# EAGLE design cable 3 (EAGLE 7.6.0)
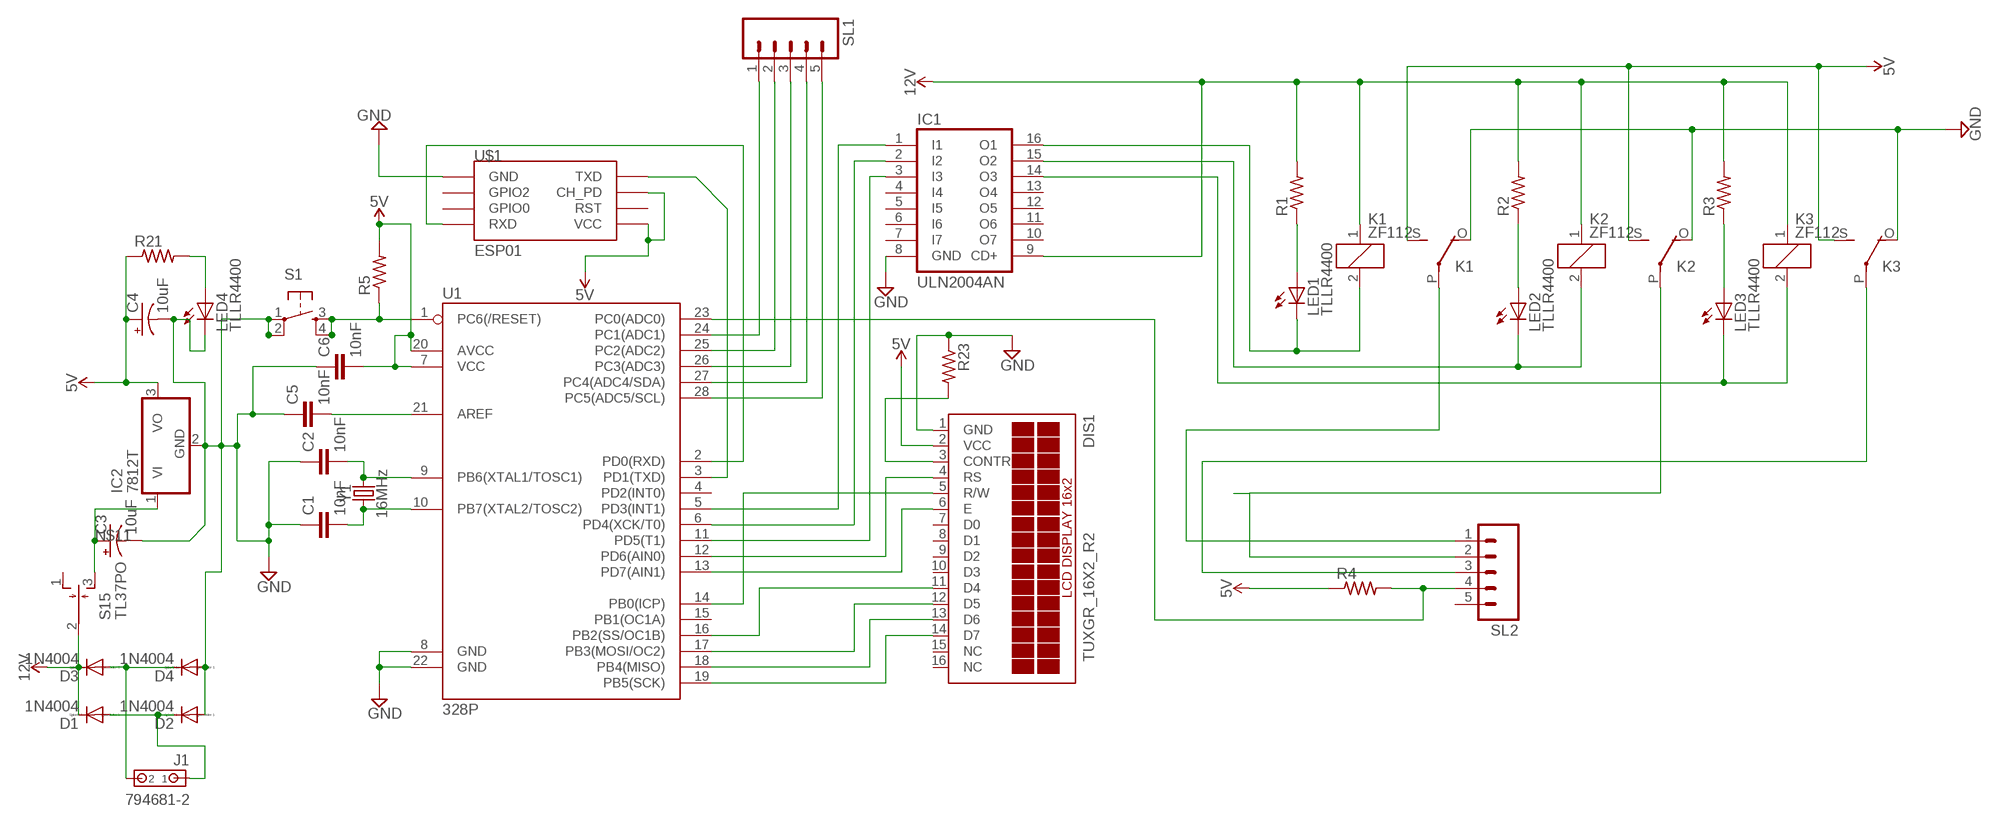
[diagram p0: schematic, sheet 1]

## Parts
C1  10nF  10NF-PTH-10MM-10000V-1-%  [CAP-PTH-10MM]
C2  10nF  10NF-PTH-10MM-10000V-1-%  [CAP-PTH-10MM]
C3  10uF  10UF-POLAR-RADIAL-2.5MM-KIT-25V-20%  [CPOL-RADIAL-2.5MM-5MM-KIT]
C4  10uF  10UF-POLAR-RADIAL-2.5MM-KIT-25V-20%  [CPOL-RADIAL-2.5MM-5MM-KIT]
C5  10nF  10NF-PTH-10MM-10000V-1-%  [CAP-PTH-10MM]
C6  10nF  10NF-PTH-10MM-10000V-1-%  [CAP-PTH-10MM]
D1  1N4004  [DO41-10]
D2  1N4004  [DO41-10]
D3  1N4004  [DO41-10]
D4  1N4004  [DO41-10]
DIS1  TUXGR_16X2_R2  [TUXGR_16X2_R2]
IC1  ULN2004AN  [DIL16]
IC2  7812T  [TO220H]
J1  794681-2  [794681-2]
K1  ZF112  [ZF112]
K2  ZF112  [ZF112]
K3  ZF112  [ZF112]
LED1  TLLR4400  [LED3MM]
LED2  TLLR4400  [LED3MM]
LED3  TLLR4400  [LED3MM]
LED4  TLLR4400  [LED3MM]
R1  R-US_0207/12  [0207/12]
R2  R-US_0207/12  [0207/12]
R3  R-US_0207/12  [0207/12]
R4  R-US_0207/12  [0207/12]
R5  R-US_0207/12  [0207/12]
R21  R-US_0207/12  [0207/12]
R23  R-US_0207/12  [0207/12]
S1  TAC_SWITCHPTH  [TACTILE-PTH]
S15  TL37PO  [TL3XPO]
SL1  MA05  [05PA]
SL2  MA05  [05PA]
U1  328P  ATMEGA328P_PDIP  [DIP28]
U$1  ESP01  [ESP01]
Y1  16MHz  CRYSTAL-16MHZPTH-HC49US  [HC49US]

## Nets
5V: C4.1(+) C6.2 DIS1.2(VCC) IC2.3(VO) K1.S(2:S) K2.S(2:S) K3.S(2:S) R4.1 R5.2 R21.1 U1.7(VCC) U1.20(AVCC) U$1.CH_PD U$1.VCC
12V: D1.C D3.C IC1.9(CD+) K1.1 K2.1 K3.1 R1.2 R2.2 R3.2 S15.2(P)
GND: C1.1 C2.1 C3.2(-) C4.2(-) C5.1 C6.1 D2.A D4.A DIS1.1(GND) IC1.8(GND) IC2.2(GND) K1.O(2:O) K2.O(2:O) K3.O(2:O) LED4.K(C) R23.1 S1.1 S1.2 U1.8(GND) U1.22(GND) U$1.GND
N$1: DIS1.3(CONTR) R23.2
N$2: U1.2(PD0(RXD)) U$1.RX(RXD)
N$3: C2.2 U1.9(PB6(XTAL1/TOSC1)) Y1.2
N$4: C1.2 U1.10(PB7(XTAL2/TOSC2)) Y1.1
N$5: LED4.A R21.2
N$6: C5.2 U1.21(AREF)
N$7: SL1.4 U1.27(PC4(ADC4/SDA))
N$9: R5.1 S1.3 S1.4 U1.1(PC6(/RESET))
N$10: D3.A D4.C J1.2
N$11: C3.1(+) IC2.1(VI) S15.3(S)
N$12: U1.3(PD1(TXD)) U$1.TX(TXD)
N$13: DIS1.11(D4) U1.16(PB2(SS/OC1B))
N$14: DIS1.12(D5) U1.17(PB3(MOSI/OC2))
N$15: DIS1.13(D6) U1.18(PB4(MISO))
N$16: SL1.5 U1.28(PC5(ADC5/SCL))
N$17: DIS1.14(D7) U1.19(PB5(SCK))
N$18: DIS1.6(E)
N$19: DIS1.4(RS) U1.12(PD6(AIN0))
N$20: LED1.A R1.1
N$21: IC1.16(O1) K1.2 LED1.K(C)
N$22: IC1.15(O2) K2.2 LED2.K(C)
N$23: LED2.A R2.1
N$24: IC1.14(O3) K3.2 LED3.K(C)
N$25: LED3.A R3.1
N$26: IC1.1(I1) U1.5(PD3(INT1))
N$27: IC1.2(I2) U1.6(PD4(XCK/T0))
N$28: K1.P(2:P) SL2.1
N$29: R4.2 SL2.4 U1.23(PC0(ADC0))
N$30: DIS1.5(R/W) U1.14(PB0(ICP))
N$31: SL1.3 U1.26(PC3(ADC3))
N$32: K2.P(2:P) SL2.2
N$33: K3.P(2:P) SL2.3
N$34: SL1.2 U1.25(PC2(ADC2))
N$35: SL1.1 U1.24(PC1(ADC1))
N$48: IC1.3(I3) U1.11(PD5(T1))
N$50: D1.A D2.C J1.1
Unconnected: DIS1.7(D0) DIS1.8(D1) DIS1.9(D2) DIS1.10(D3) DIS1.15(NC) DIS1.16(NC) IC1.4(I4) IC1.5(I5) IC1.6(I6) IC1.7(I7) IC1.10(O7) IC1.11(O6) IC1.12(O5) IC1.13(O4) S15.1(O) SL2.5 U1.4(PD2(INT0)) U1.13(PD7(AIN1)) U1.15(PB1(OC1A)) U$1.GPIO0 U$1.GPIO2 U$1.RST

## Library data of the parts
C1 C2 C5 C6 = SparkFun-Capacitors:10NF: 0.01uF/10nF/10,000pF ceramic capacitors A capacitor is a passive two-terminal electrical component used to store electrical energy temporarily in an electric field. CAP-09321; PROD_ID: CAP-09321
C3 C4 = SparkFun-Capacitors:10UF-POLAR: 10.0µF polarized capacitors A capacitor is a passive two-terminal electrical component used to store electrical energy temporarily in an electric field.; PROD_ID: CAP-08440
D1-D4 = diode:1N4004: DIODE general purpose rectifier, 1 A
DIS1 = display-lcd:TUXGR_16X2_R2: Tuxgraphics LCD display 16x2 characters reflective, without background light Source: tuxgr_12x2_r2.pdf; OC_FARNELL: unknown; OC_NEWARK: unknown
IC1 = uln-udn:ULN2004A: DRIVER ARRAY
IC2 = linear:78*: Positive VOLTAGE REGULATOR Source: http://cache.national.com/ds/LM/LM78L05.pdf http://www.fairchildsemi.com/ds/LM/LM7805.pdf
J1 = con-amp:794681-2: Micro MATE-N-LOK Connectors grid 1.5mm Dual Row Through Hole Vertical Metal Through Hole Holddowns Source: ENG_CD_794681_E.pdf
K1-K3 = relay:ZF112: RELAY 1 x switch; OC_FARNELL: unknown; OC_NEWARK: unknown
LED1-LED4 = led:TLLR4400: Low Current (2mA) LED 3 mm Tinted Diffused Package color RED Source: Data sheet <http://www.farnell.com/datasheets/391100.pdf>; MF: VISHAY SEMICONDUCTOR; OC_FARNELL: 1612437
R1-R5 R21 R23 = rcl:R-US_: RESISTOR, American symbol
S1 = SparkFun-Retired:TAC_SWITCH: Momentary Switch Button commonly used for reset or general input. Spark Fun Electronics SKU : COM-00097 SMT- SWCH-08247
S15 = switch:TL37PO: TINY SWITCH MOM OFF MOM Source: http://www2.produktinfo.conrad.com/datenblaetter/700000-724999/705152-da-01-de-Subminiaturschalter_TL_36YO.pdf
SL1 SL2 = con-amp-quick:MA05: AMP QUICK CONNECTOR; OC_FARNELL: unknown; OC_NEWARK: unknown
U1 = SparkFun-IC-Microcontroller:ATMEGA328P_PDIP: Atmel 328P Through hole ATMEGA328P uC used in the Arduino 32kb flash, 1k EEPROM, 2k SRAM Datasheet <http://www.sparkfun.com/datasheets/Components/SMD/ATMega328.pdf> SparkFun Products Storefront component: AVR 28 Pin 20MHz 32K 6A/D - ATMega328P <https://www.sparkfun.com/products/9061> (COM-09061) SparkFun Simon Says - Through-Hole Soldering Kit <https://www.sparkfun.com/products/10547> (KIT-10547) SparkFun Learn to Solder - Simon Says <https://www.sparkfun.com/products/13708> (KIT-13708) SparkFun BigTime Watch Kit <https://www.sparkfun.com/products/11734> (KIT-11734) SparkFun ClockIt <https://www.sparkfun.com/products/10930> (KIT-10930) SparkFun Serial Enabled LCD Kit <https://www.sparkfun.com/products/10097> (LCD-10097) SparkFun Simon Tilts - Through Hole Soldering Kit <https://www.sparkfun.com/products/12634> (KIT-12634) SparkFun Frequency Counter Kit <https://www.sparkfun.com/products/10140> (KIT-10140) FabFM Radio Kit <https://www.sparkfun.com/products/11043> (KIT-11043) SparkFun Binary Blaster Kit <https://www.sparkfun.com/products/12037> (KIT-12037) SparkFun Metro-Gnome <https://www.sparkfun.com/products/9236> (KIT-09236) ATmega328 with Arduino Optiboot (Uno) <https://www.sparkfun.com/products/10524> (DEV-10524); PROD_ID: IC-09136
U$1 = esp8266modules:ESP01: ESP8266 Wifi module 01
Y1 = SparkFun-Clocks:CRYSTAL-16MHZ: 16MHz Crystal Digikey Example <http://www.digikey.com/product-search/en?keywords=535-9122-1-ND> Frequency: 16MHz Frequency Stability: ±50ppm Frequency Tolerance: ±20ppm Load Capacitance: 18pF SparkFun Products: Pro Micro -5V/16MHz <https://www.sparkfun.com/products/12640> SparkFun Serial Enabled LCD Kit <https://www.sparkfun.com/products/10097>; PROD_ID: XTAL-08181; SF_ID: COM-00536

## Board
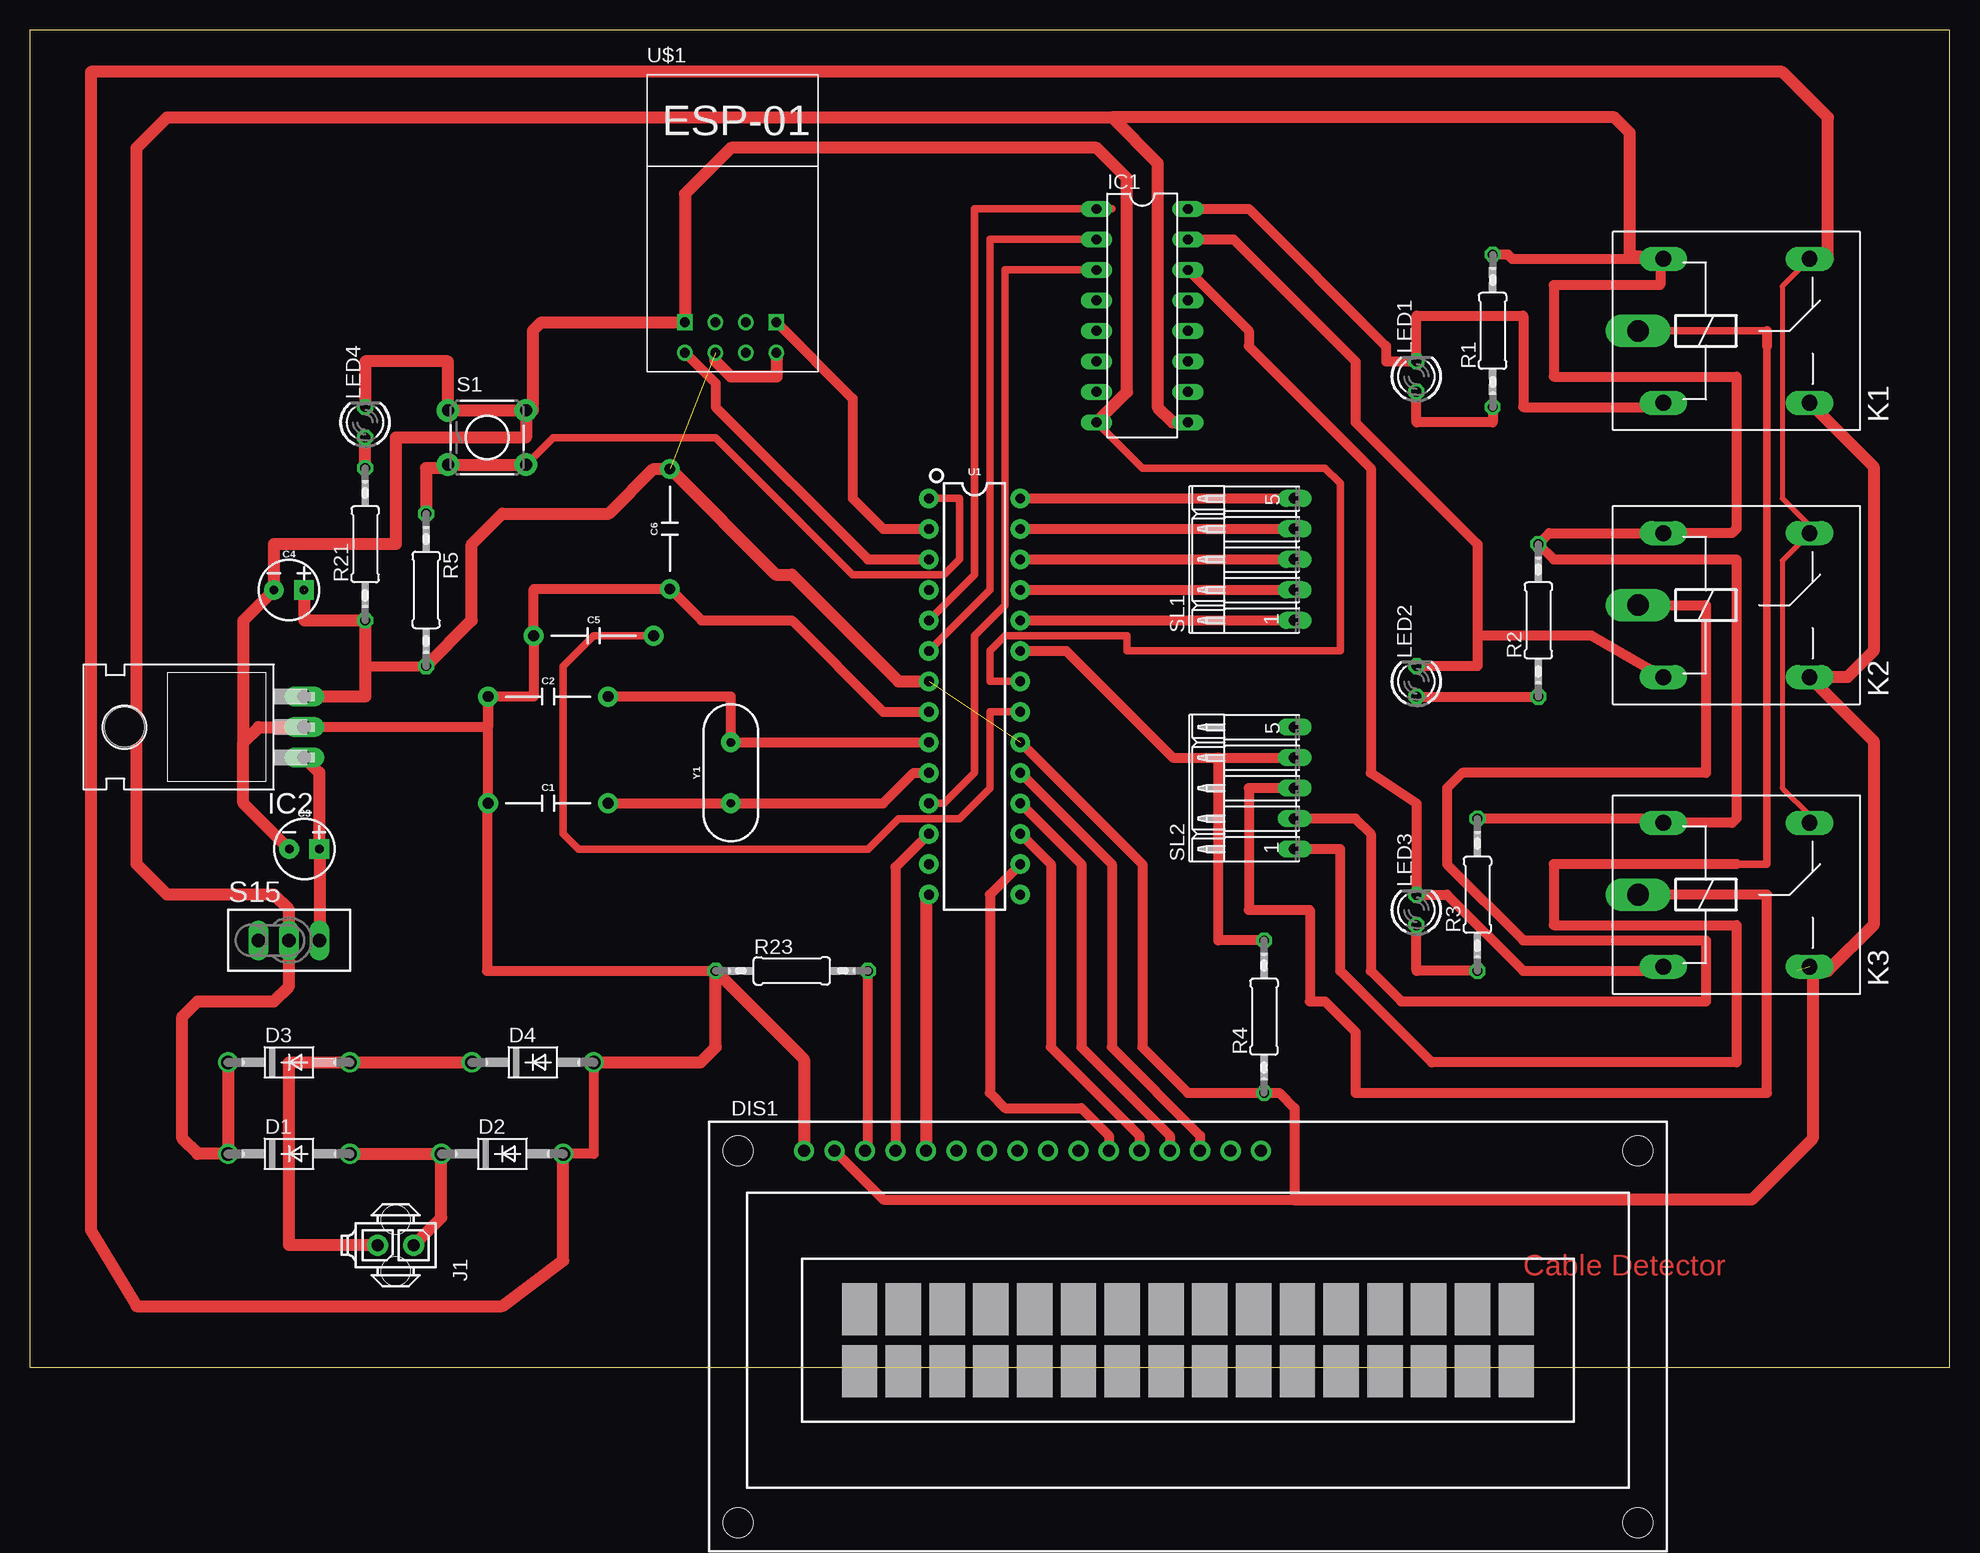
[diagram p1: board, top side]

Size 160 x 111.43 mm. Coordinates in mm from the lower left corner, seen from the top.
Outline: 0,0 160,0 160,111.43 0,111.43 0,0
Copper layers (1*16): Top 0.035mm / dielectric 1.5mm / Bottom 0.035mm
Design rules "default": minimum track width 10mil, minimum drill 24mil, track to track 8mil, track to pad 8mil, pad to pad 8mil, via to via 8mil, smd to smd 8mil, copper to edge 40mil, drill to drill 8mil, minimum pad ring 10mil, minimum via ring 8mil, stop-mask expansion 4mil, vias tented up to drill 0mil, thermal gap 10mil

### Footprints (pad centres in the part's own frame; a part is rotated, then mirrored left to right if it is on the bottom)
CAP-PTH-10MM = drill 0.9 pad 1.651: 1 -5,0; 2 5,0
CPOL-RADIAL-2.5MM-5MM-KIT = drill 0.7 pad 1.651 square: 1 1.25,0 | drill 0.7 pad 1.651: 2 -1.25,0
DO41-10 = drill 1.118: A 5.08,0; C -5.08,0
TUXGR_16X2_R2 = drill 1 pad 1.676: 1 -32,15.5; 2 -29.46,15.5; 3 -26.92,15.5; 4 -24.38,15.5; 5 -21.84,15.5; 6 -19.3,15.5; 7 -16.76,15.5; 8 -14.22,15.5; 9 -11.68,15.5; 10 -9.14,15.5; 11 -6.6,15.5; 12 -4.06,15.5; 13 -1.52,15.5; 14 1.02,15.5; 15 3.56,15.5; 16 6.1,15.5 | hole 2.5: -37.5,-15.5; 37.5,-15.5; -37.5,15.5; 37.5,15.5
DIL16 = drill 0.813 long: 1 -8.89,-3.81; 2 -6.35,-3.81; 3 -3.81,-3.81; 4 -1.27,-3.81; 5 1.27,-3.81; 6 3.81,-3.81; 7 6.35,-3.81; 8 8.89,-3.81; 9 8.89,3.81; 10 6.35,3.81; 11 3.81,3.81; 12 1.27,3.81; 13 -1.27,3.81; 14 -3.81,3.81; 15 -6.35,3.81; 16 -8.89,3.81
TO220H = drill 1.118 long: 1 -2.54,-10.16; 2 0,-10.16; 3 2.54,-10.16 | hole 3.302: 0,4.826
794681-2 = drill 1 pad 1.778: 1 0,-1.5; 2 0,1.5 | hole 2.4: 2.13,0; -2.17,0
ZF112 = drill 1.321 long: 1 -6.096,5.994; 2 -6.096,-5.994; O 6.096,5.994; S 6.096,-5.994 | drill 1.803 long: P -8.204,0
LED3MM = drill 0.813 octagon: A -1.27,0; K 1.27,0
0207/12 = drill 0.813 octagon: 1 -6.35,0; 2 6.35,0
TACTILE-PTH = drill 1.016 pad 1.88: 1 -3.251,2.261; 2 3.251,2.261; 3 -3.251,-2.261; 4 3.251,-2.261
TL3XPO = drill 1.1 pad 1.422 long: 1 -2.54,0; 2 0,0; 3 2.54,0
05PA = drill 0.914 long: 1 -5.08,0; 2 -2.54,0; 3 0,0; 4 2.54,0; 5 5.08,0
DIP28 = drill 0.813 pad 1.626: 1 -16.51,-3.81; 2 -13.97,-3.81; 3 -11.43,-3.81; 4 -8.89,-3.81; 5 -6.35,-3.81; 6 -3.81,-3.81; 7 -1.27,-3.81; 8 1.27,-3.81; 9 3.81,-3.81; 10 6.35,-3.81; 11 8.89,-3.81; 12 11.43,-3.81; 13 13.97,-3.81; 14 16.51,-3.81; 15 16.51,3.81; 16 13.97,3.81; 17 11.43,3.81; 18 8.89,3.81; 19 6.35,3.81; 20 3.81,3.81; 21 1.27,3.81; 22 -1.27,3.81; 23 -3.81,3.81; 24 -6.35,3.81; 25 -8.89,3.81; 26 -11.43,3.81; 27 -13.97,3.81; 28 -16.51,3.81
ESP01 = drill 0.8: CH_PD -1.285,-8.178; GPIO0 1.255,-5.638; GPIO2 -1.285,-5.638; RST 1.255,-8.178; TX -3.825,-8.178; VCC 3.795,-8.178 | drill 0.8 square: GND -3.825,-5.638; RX 3.795,-5.638
HC49US = drill 0.7 pad 1.651: 1 -2.54,0; 2 2.54,0

### Placement (x,y rotation side)
C1  43.18,46.99 0 top
C2  43.18,55.88 0 top
C3  22.86,43.18 0 top
C4  21.59,64.77 0 top
C5  46.99,60.96 0 top
C6  53.34,69.85 90 top
D1  21.59,17.78 0 top
D2  39.37,17.78 0 top
D3  21.59,25.4 0 top
D4  41.91,25.4 0 top
DIS1  96.52,2.54 0 top
IC1  92.71,87.63 270 top
IC2  12.7,53.34 90 top
J1  30.48,10.16 90 top
K1  142.24,86.36 0 top
K2  142.24,63.5 0 top
K3  142.24,39.37 0 top
LED1  115.57,82.55 90 top
LED2  115.57,57.15 90 top
LED3  115.57,38.1 90 top
LED4  27.94,78.74 90 top
R1  121.92,86.36 90 top
R2  125.73,62.23 90 top
R3  120.65,39.37 90 top
R4  102.87,29.21 90 top
R5  33.02,64.77 270 top
R21  27.94,68.58 90 top
R23  63.5,33.02 0 top
S1  38.1,77.47 0 top
S15  21.59,35.56 0 top
SL1  105.41,67.31 90 top
SL2  105.41,48.26 90 top
U1  78.74,55.88 270 top
U$1  58.42,92.71 0 top
Y1  58.42,49.53 90 top

### Tracks (layer width: path | path; a pad name or v marks a point on that pad's centre or on a via)
5V  (4 unrouted)
  Top 0.813: R21.1 27.94,58.42 R5.2 | DIS1.2 71.13,13.97 105.41,13.97 105.41,21.59 104.14,22.86 R4.1 96.52,22.86 92.71,26.67 92.71,41.91 U1.20
  Top 1.016: 22.86,64.75 22.86,62.23 R21.1 27.94,55.88 IC2.3 | K1.S 153.67,75.03 153.67,59.69 151.49,57.51 K2.S 153.67,52.17 153.67,36.83 149.86,33.02 147.32,33.02 | K3.S 148.59,33.12 148.59,19.05 143.51,13.97 105.41,13.97 | R5.2 36.83,62.23 36.83,68.58 39.37,71.12 48.26,71.12 51.99,74.85 C6.2 62.15,66.04 63.5,66.04 72.39,57.15 U1.7 | U$1.VCC 62.23,84.52 62.23,82.55 58.42,82.55 57.13,83.84 U$1.CH_PD
12V
  Top 0.813: R3.2 135.79,45.72 K3.1 141.88,45.36 142.24,45.72 142.24,67.31 127,67.31 R2.2 126.64,69.49 K2.1 141.88,69.49 142.24,69.85 142.24,82.55 127,82.55 127,90.17 135.89,90.17 135.89,92.1 K1.1 123.55,92.35 123.19,92.71 R1.2
  Top 1.016: D3.C D1.C 13.97,17.78 12.7,19.05 12.7,29.21 13.97,30.48 20.32,30.48 21.59,31.75 S15.2 21.59,38.1 20.32,39.37 11.43,39.37 8.89,41.91 8.89,101.6 11.43,104.14 90.17,104.14 | 90.17,104.14 93.98,100.33 93.98,80.01 95.25,78.74 IC1.9 | K1.1 133.35,92.61 133.35,102.87 132.08,104.14 90.17,104.14
GND
  Top 0.406: K1.O 146.05,90.07 146.05,72.39 148.34,70.1 K2.O 146.05,67.21 146.05,48.26 148.34,45.97 K3.O
  Top 0.61: IC1.8 92.71,74.93 107.95,74.93 109.22,73.66 109.22,59.69 91.44,59.69 91.44,60.96 81.28,60.96 80.01,59.69 80.01,57.15 U1.22
  Top 0.813: C2.1 C1.1 38.1,46.91 38.1,33.02 R23.1 | D4.A 46.99,17.78 D2.A | C2.1 38.18,53.34 IC2.2 | C2.1 41.99,55.88 C5.1 41.99,64.85 C6.1 55.96,62.23 63.5,62.23 71.12,54.61 U1.8
  Top 1.016: C3.2 17.78,47.01 17.78,52.07 | 17.78,52.07 19.05,53.34 IC2.2 | 17.78,52.07 17.78,62.21 C4.2 20.32,64.77 20.32,68.58 30.48,68.58 30.48,77.47 41.35,77.47 S1.2 | LED4.K 27.94,83.82 34.85,83.82 S1.1 S1.2 | S1.2 41.91,79.73 41.91,86.36 42.62,87.07 U$1.GND 54.59,97.78 58.42,101.6 88.9,101.6 91.44,99.06 91.44,81.28 IC1.8 | DIS1.1 64.52,25.65 R23.1 57.15,26.67 55.88,25.4 D4.A | K1.O 149.86,92.35 149.86,104.14 146.05,107.95 5.08,107.95 5.08,11.43 8.89,5.08 39.37,5.08 44.45,8.89 D2.A
N$1
  Top 0.813: DIS1.3 69.85,18.29 R23.2
N$2
  Top 0.813: U$1.RX 68.58,80.71 68.58,72.39 71.12,69.85 U1.2
N$3
  Top 0.813: C2.2 58.42,55.88 Y1.2 U1.9
N$4
  Top 0.813: C1.2 Y1.1 71.12,46.99 73.66,49.53 U1.10
N$5
  Top 1.016: R21.2 LED4.A
N$6
  Top 0.61: C5.2 46.99,60.96 44.45,58.42 44.45,44.45 45.72,43.18 69.85,43.18 72.39,45.72 77.47,45.72 80.01,48.26 80.01,54.61 U1.21
N$7
  Top 0.813: U1.27 SL1.4
N$9
  Top 0.61: S1.4 43.61,77.47 57.15,77.47 68.58,66.04 76.2,66.04 77.47,67.31 77.47,72.39 U1.1
  Top 1.016: R5.1 33.02,74.93 34.85,74.93 S1.3 S1.4
N$10
  Top 1.016: J1.2 21.59,10.16 21.59,25.4 D3.A D4.C
N$11
  Top 1.016: S15.3 24.13,43.16 C3.1 24.11,49.55 IC2.1
N$12
  Top 0.813: U$1.TX 57.15,81.98 57.15,80.01 69.85,67.31 U1.3
N$13
  Top 0.813: U1.16 80.01,39.37 80.01,22.86 81.28,21.59 87.63,21.59 89.92,19.3 DIS1.11
N$14
  Top 0.813: U1.17 85.09,41.91 85.09,26.67 92.46,19.3 DIS1.12
N$15
  Top 0.813: U1.18 87.63,41.91 87.63,26.67 95,19.3 DIS1.13
N$16
  Top 0.813: U1.28 SL1.5
N$17
  Top 0.813: U1.19 90.17,41.91 90.17,26.67 97.54,19.3 DIS1.14
N$19
  Top 0.813: U1.12 72.14,41.66 DIS1.4
N$20
  Top 0.813: R1.1 121.92,78.74 115.57,78.74 LED1.A
N$21
  Top 0.813: IC1.16 101.6,96.52 113.03,85.09 113.03,83.82 LED1.K 115.57,87.63 124.46,87.63 124.46,80.01 137.16,80.01 136.8,80.37 K1.2
N$22
  Top 0.813: K2.2 130.15,60.96 120.65,60.96 | 120.65,60.96 120.65,58.42 LED2.K | 120.65,60.96 120.65,68.58 110.49,78.74 110.49,83.82 100.33,93.98 IC1.15
N$23
  Top 0.813: LED2.A R2.1
N$24
  Top 0.813: K3.2 136.14,33.27 135.89,33.02 124.46,33.02 118.11,39.37 LED3.K 115.57,46.99 111.76,49.53 111.76,74.93 101.6,85.09 101.6,86.36 IC1.14
N$25
  Top 0.813: R3.1 115.57,33.02 LED3.A
N$26
  Top 0.61: 90.17,96.52 IC1.1 78.74,96.52 78.74,66.04 U1.5
N$27
  Top 0.61: IC1.2 80.01,93.98 80.01,64.77 U1.6
N$28
  Top 0.61: K1.P 144.78,86.36 | 144.78,85.09 144.78,41.91 142.24,41.91
  Top 0.813: 144.78,86.36 144.78,85.09 | 142.24,41.91 127,41.91 127,36.83 142.24,36.83 142.24,25.4 116.84,25.4 109.22,33.02 109.22,43.18 SL2.1
N$29
  Top 0.813: 99.06,50.8 SL2.4 | R4.2 99.06,35.56 99.06,50.8 | U1.23 86.36,59.69 95.25,50.8 99.06,50.8
N$30
  Top 1.016: U1.14 74.68,39.12 DIS1.5
N$31
  Top 0.813: U1.26 SL1.3
N$32
  Top 0.813: K2.P 139.7,63.5 139.7,49.53 119.38,49.53 118.11,48.26 118.11,41.91 124.46,35.56 139.7,35.56 139.7,30.48 114.3,30.48 111.76,33.02 111.76,44.45 110.49,45.72 SL2.2
N$33
  Top 0.813: SL2.3 101.6,48.26 101.6,38.1 106.68,38.1 106.68,30.48 107.95,30.48 110.49,27.94 110.49,22.86 144.78,22.86 144.78,39.37 K3.P
N$34
  Top 0.813: U1.25 SL1.2
N$35
  Top 0.813: U1.24 SL1.1
N$48
  Top 0.61: IC1.3 81.28,91.44 81.28,63.5 78.74,60.96 78.74,49.53 76.2,46.99 U1.11
N$50
  Top 1.016: D1.A D2.C 34.29,12.47 J1.1

### Text on the board
Top: Cable Detector